# Altium schematic sheet sheet6_power_supply.SchDoc: Power Supply
size A3; Organization: Nordic Semiconductor; DocumentNumber: 6; SheetNumber: 6; SheetTotal: 6; CompanyName: Nordic Semiconductor; DocumentSize: A3
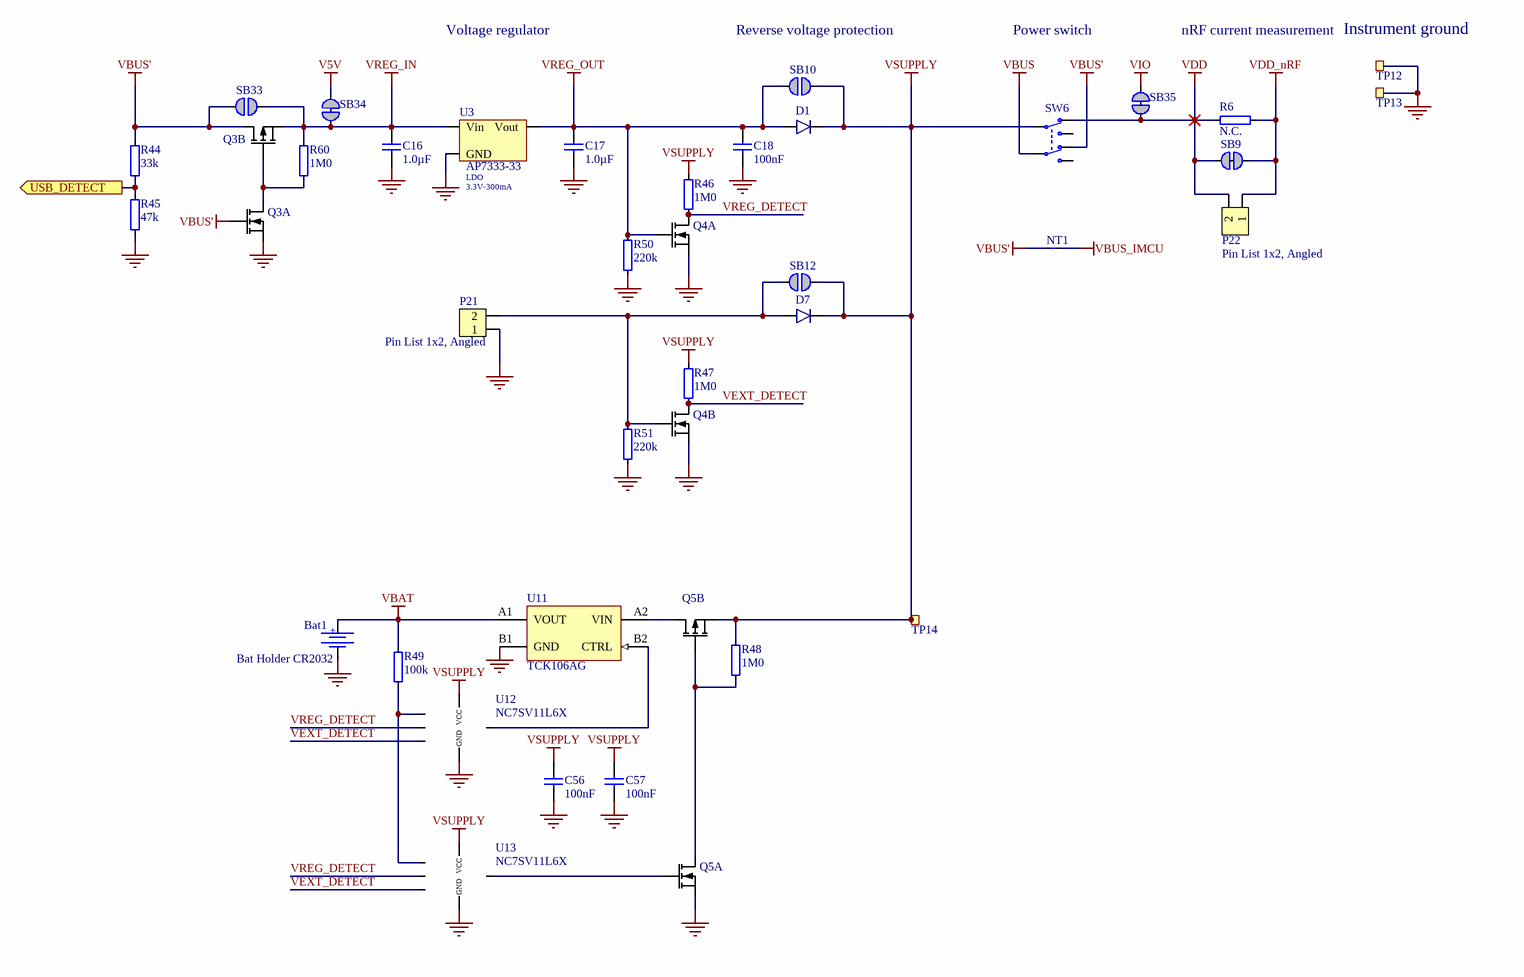
[diagram p0: sheet6_power_supply.SchDoc]

## Parts
Bat1  Bat Holder CR2032  [L-KLS5-CR2032-23-B1]
C16  1.0µF  [CAPC1608X06L]
C17  1.0µF  [CAPC1608X06L]
C18  100nF  [CAPC1005X04L]
C56  100nF  [CAPC0603X03L_C]
C57  100nF  [CAPC0603X03L_C]
D1  NSR0620P2T5G  [SODFL100X40-2N]  (value not drawn)
D7  NSR0620P2T5G  [SODFL100X40-2N]  (value not drawn)
NT1  NetTie_200um  [NetTie_200um]  (value not drawn)  (net tie, no BOM)
P21  Pin List 1x2, Angled  [LIST_ANG_1x2-SMD-2.54MM]
P22  Pin List 1x2, Angled  [LIST_ANG_1x2-SMD-2.54MM]
Q3  TSM2537CQ RFG  [DFN65P200X200X80_HS-6N]  (value not drawn)  (parts A,B of 2)
Q4  TSM250N02DCQ RFG  [DFN65P200X200X80_HS-6N]  (value not drawn)  (parts A,B of 2)
Q5  TSM2537CQ RFG  [DFN65P200X200X80_HS-6N]  (value not drawn)  (parts A,B of 2)
R6  N.C.  [RESC1005X04L_NC]
R44  33k  [RESC0603X03L_C]
R45  47k  [RESC0603X03L_C]
R46  1M0  [RESC0603X03L_C]
R47  1M0  [RESC0603X03L_C]
R48  1M0  [RESC0603X03L_C]
R49  100k  [RESC0603X03L_C]
R50  220k  [RESC0603X03L_C]
R51  220k  [RESC0603X03L_C]
R60  1M0  [RESC0603X03L_C]
SB9  Solderbridge  [Solderbridge_Shorted]  (value not drawn)  (net tie, no BOM)
SB10  Solderbridge  [Solderbridge]  (value not drawn)  (no BOM)
SB12  Solderbridge  [Solderbridge]  (value not drawn)  (no BOM)
SB33  Solderbridge  [Solderbridge]  (value not drawn)  (no BOM)
SB34  Solderbridge  [Solderbridge_Shorted]  (value not drawn)  (net tie, no BOM)
SB35  Solderbridge  [Solderbridge_Shorted_Power]  (value not drawn)  (net tie, no BOM)
SW6  MK-22D14-G2  [MK-22D14-G2]  (value not drawn)
TP12  TP  [TESTPAD-TH]  (value not drawn)  (no BOM)
TP13  TP  [TESTPAD-TH]  (value not drawn)  (no BOM)
TP14  Ø1.0mm,SMD  [TP_SMD_D1.0mm]  (value not drawn)  (no BOM)
U3  AP7333-33SAG-7  [SOT-23A]  (value not drawn)
U11  TCK106AG  [BGA4C40P2X2_76X76X62]
U12  NC7SV11L6X  [DFN1410-6N]
U13  NC7SV11L6X  [DFN1410-6N]

## Ports
USB_DETECT (out)

## Nets
GND: Bat1.2 C16.1 C17.1 C18.1 C56.1 C57.1 P21.1 Q3.1(S1) Q4.1(S1) Q4.4(S2) Q5.1(S1) R45.2 R50.2 R51.2 TP12.1 TP13.1 U3.3(GND) U11.B1(GND) U12.2(GND) U13.2(GND)
V5V: SB34.1
VBAT: Bat1.1 R49.1 U11.A1(VOUT)
VBUS: SW6.5(COM-2)
VBUS': NT1.1 Q3.2(G1) Q3.3(D2) R44.1 SB33.2 SW6.6(N.C-2)
VBUS_IMCU: NT1.2
VDD: P22.2 R6.1 SB9.2 SB35.2 SW6.3(N.C-1)
VDD_nRF: P22.1 R6.2 SB9.1
VIO: SB35.1
VREG_IN: C16.2 Q3.4(S2) R60.1 SB33.1 SB34.2 U3.1(Vin)
VREG_OUT: C17.2 C18.2 D1.2(A) Q4.2(G1) R50.1 SB10.2 U3.2(Vout)
VSUPPLY: C56.2 C57.2 D1.1(C) D7.1(C) Q5.4(S2) R46.1 R47.1 R48.1 SB10.1 SB12.1 SW6.2(COM-1) TP14.1 U12.5(VCC) U13.5(VCC)
USB_DETECT: R44.2 R45.1 ; port USB_DETECT
VEXT_DETECT: Q4.3(D2) R47.2 U12.6(C) U13.6(C)
VREG_DETECT: Q4.6(D1) R46.2 U12.3(B) U13.3(B)
NetD7_2: D7.2(A) P21.2 Q4.5(G2) R51.1 SB12.2
NetQ3_5: Q3.5(G2) Q3.6(D1) R60.2
NetQ5_2: Q5.2(G1) U13.4(Y)
NetQ5_3: Q5.3(D2) U11.A2(VIN)
NetQ5_5: Q5.5(G2) Q5.6(D1) R48.2
NetR49_2: R49.2 U12.1(A) U13.1(A)
NetU11_B2: U11.B2(CTRL) U12.4(Y)

Not connected (* = marked no-connect by the designer): SW6 1(N.O-1) 4(N.O-2)

## Notes on the sheet
- Voltage regulator
- (near SB10) Reverse voltage protection
- Power switch
- nRF current measurement
- (near TP12) Instrument ground
- (near U3) AP7333-33
- (near U3) LDO
- (near U3) 3.3V-300mA
- Size
- Date:
- A3
- PCB Assembly Number
- Sheet         of
- Revision
- File:
- Drawn By:
- (in symbol Bat Holder L-KLS5-CR2032-23-B1) +

## Library data of the parts
Bat1 = Bat Holder L-KLS5-CR2032-23-B1: Bat Holder CR2032 SMD; Manufacturer: KLS Electronic; Artikkelnr Noca: N.A.; Pad Count: 2; Part Number: Bat Holder L-KLS5-CR2032-23-B1; Manufacturer Part Number: L-KLS5-CR2032-23-B1; Footprint Doc: CR2032_HOLDER; LatestRevisionDate: 2019-08-29; Published: 2019-08-28; Value: Bat Holder CR2032; Note: Bat Holder CR2032; Part number IPS: N.A.; ComponentLink1URL: http://www.klsele.com/admin/product_upload/20151124103736KLS5-CR2032-23-B.pdf; ComponentLink1Description: Datasheet; ComponentLink2URL: N.A.; ComponentLink2Description: Supplier link; HelpURL: http://www.klsele.com/products/connectors/Coin-Cell-Holders-Series/4685.html; Supplier 1: Cabcon; Supplier Part Number 1: L-KLS5-CR2032-23-B1; Supplier 2: Mouser; Supplier Part Number 2: 614-SMTU2032-LF; PartId: 100500651; Component Class: Connectors; Author: rsk; Part number Norautron: N.A.
C16 C17 = C0603-1µ0: Capacitor, X7R, ±10%; Manufacturer: N.A.; Part number IPS: 00000000616; Note: 16V; Artikkelnr Noca: 20039282; Pad Count: 2; Published: 2009-05-08; LatestRevisionDate: 2013-06-05; Value: 1.0µF; Part Number: C0603-1µ0; Manufacturer Part Number: N.A.; Footprint Doc: 0603; ComponentLink1URL: N.A.; ComponentLink1Description: Datasheet; ComponentLink2URL: N.A.; ComponentLink2Description: Supplier link; HelpURL: N.A.; Supplier 1: N.A.; Supplier Part Number 1: N.A.; Supplier 2: N.A.; Supplier Part Number 2: N.A.; PartId: 100200271; Component Class: Capacitors; Author: rsk; Part number Norautron: N.A.
C18 = C0402-100n: Capacitor, X7R, ±10%; Manufacturer: N.A.; Part number IPS: 00000005296; Note: 16V; Artikkelnr Noca: 20039200; Pad Count: 2; Published: 2009-05-08; LatestRevisionDate: 2009-11-23; Value: 100nF; Part Number: C0402-100n; Manufacturer Part Number: N.A.; Footprint Doc: 0402; ComponentLink1URL: N.A.; ComponentLink1Description: Datasheet; ComponentLink2URL: N.A.; ComponentLink2Description: Supplier link; HelpURL: N.A.; Supplier 1: N.A.; Supplier Part Number 1: N.A.; Supplier 2: N.A.; Supplier Part Number 2: N.A.; PartId: 100200184; Component Class: Capacitors; Author: rsk; Part number Norautron: N.A.
C56 C57 = C0201-100n: Capacitor, X5R, ±10%; Manufacturer: N.A.; Part number IPS: 00000001248, 00000002505; Note: 16V; Pad Count: 2; Part Number: C0201-100n; Manufacturer Part Number: N.A.; Footprint Doc: 0201; LatestRevisionDate: 2017-11-09; Published: 2014-11-13; Value: 100nF; Artikkelnr Noca: N.A.; ComponentLink1URL: N.A.; ComponentLink1Description: Datasheet; ComponentLink2URL: N.A.; ComponentLink2Description: Supplier link; HelpURL: N.A.; Supplier 1: N.A.; Supplier Part Number 1: N.A.; Supplier 2: N.A.; Supplier Part Number 2: N.A.; PartId: 100200078; Component Class: Capacitors; Author: rsk; Part number Norautron: N.A.
D1 D7 = NSR0620P2T5G: 20V schottky barrier diode, Vf 350 mV @ 100 mA, Ir 2.0 µA @ 10 V, If 500 mA; Manufacturer: ON Semiconductor; Part number IPS: 00000009952; Note: N.A.; Artikkelnr Noca: 10029169; Pad Count: 2; Part Number: NSR0620P2T5G; Manufacturer Part Number: NSR0620P2T5G; LatestRevisionDate: 2016-07-07; Published: 2016-07-07; Value: NSR0620P2T5G; Footprint Doc: SOD-923; ComponentLink1URL: N.A.; ComponentLink1Description: Datasheet; ComponentLink2URL: N.A.; ComponentLink2Description: Supplier link; HelpURL: http://www.onsemi.com/pub_link/Collateral/NSR0620P2-D.PDF; Supplier 1: Digi-Key; Supplier Part Number 1: NSR0620P2T5GOSCT-ND; Supplier 2: N.A.; Supplier Part Number 2: N.A.; PartId: 101300131; Component Class: Semiconductors; Author: rsk; Part number Norautron: N.A.
NT1 = NetTie 0.2mm: Net Tie; Manufacturer: N.A.; Pad Count: 2; Part Number: NetTie 0.2mm; PartId: 100500654; Component Class: Connectors; Author: rsk; Manufacturer Part Number: N.A.; ComponentLink1URL: N.A.; ComponentLink1Description: Datasheet; ComponentLink2URL: N.A.; ComponentLink2Description: Supplier link; HelpURL: N.A.; Footprint Doc: NetTie; LatestRevisionDate: 2019-10-07; Published: 2019-10-07; Value: NetTie_200um; Note: N.A.; Supplier 1: N.A.; Supplier Part Number 1: N.A.; Supplier 2: N.A.; Supplier Part Number 2: N.A.; Artikkelnr Noca: N.A.; Part number IPS: N.A.; Part number Norautron: N.A.
P21 P22 = Pin List Ang 1x2 SMD, 2.54mm: Pin List 1x2, 2.54mm (100mil), Right Angled, SMD; Manufacturer: W-CON; Manufacturer Part Number: 1125B-1102S0Z135R2; Part number IPS: 00000009972; Note: N.A.; Artikkelnr Noca: 55010023; Pad Count: 2; Part Number: Pin List Ang 1x2 SMD, 2.54mm; Footprint Doc: LIST_ANG_1x2-SMD-2.54MM; LatestRevisionDate: 2016-05-26; Published: 2016-01-22; Value: Pin List 1x2, Angled; ComponentLink1URL: N.A.; ComponentLink1Description: Datasheet; ComponentLink2URL: N.A.; ComponentLink2Description: Supplier link; HelpURL: \\hizz\pro\app9717\Datasheet\connectors\W-CON\1125B-11XXXXZXXXXX.pdf; Supplier 1: Cabcon; Supplier Part Number 1: 1125B-1102S0Z135R2; Supplier 2: Samtec; Supplier Part Number 2: TSM-102-01-L-SH-A; PartId: 100500354; Component Class: Connectors; Author: rsk; Part number Norautron: N.A.
Q3 Q5 = TSM2537CQ RFG: Dual N & P Ch MOFET, 11.6A/9A, 90mOhm max, 6.25W; Manufacturer: Taiwan Semiconductor; Part number IPS: 00000001702; Note: N.A.; Pad Count: 6; Part Number: TSM2537CQ RFG; Manufacturer Part Number: TSM2537CQ RFG; ComponentLink1URL: https://www.taiwansemi.com/products/datasheet/TSM2537CQ_A1610.pdf; ComponentLink1Description: Datasheet; ComponentLink2URL: N.A.; ComponentLink2Description: Supplier link; HelpURL: https://www.taiwansemi.com/products/datasheet/TSM2537CQ_A1610.pdf; Footprint Doc: VDFN-6; LatestRevisionDate: 2018-10-29; Published: 2018-10-29; Value: TSM2537CQ RFG; Supplier 1: Digi-Key; Supplier Part Number 1: TSM2537CQRFGCT-ND; Supplier 2: N.A.; Supplier Part Number 2: N.A.; Artikkelnr Noca: N.A.; PartId: 101300160; Component Class: Semiconductors; Author: rsk; Part number Norautron: N.A.
Q4 = TSM250N02DCQ RFG: Dual N Ch MOFET, 5.8A, 55mOhm max, 620mW; Manufacturer: Taiwan Semiconductor; Part number IPS: 00000001703; Note: N.A.; Pad Count: 6; Part Number: TSM250N02DCQ RFG; Manufacturer Part Number: TSM250N02DCQ RFG; LatestRevisionDate: 2018-10-31; Published: 2018-10-31; Value: TSM250N02DCQ RFG; Artikkelnr Noca: N.A.; Footprint Doc: VDFN-6; ComponentLink1URL: https://www.taiwansemi.com/products/datasheet/TSM250N02D_B15.pdf; ComponentLink1Description: Datasheet; ComponentLink2URL: N.A.; ComponentLink2Description: Supplier link; HelpURL: https://www.taiwansemi.com/products/datasheet/TSM250N02D_B15.pdf; Supplier 1: Digi-Key; Supplier Part Number 1: TSM250N02DCQRFGCT-ND; Supplier 2: N.A.; Supplier Part Number 2: N.A.; PartId: 101300161; Component Class: Semiconductors; Author: rsk; Part number Norautron: N.A.
R6 = R0402-N.C.: Not mounted; Manufacturer: N.A.; Note: Chip Res; Assembly: Not mounted; Pad Count: 2; Part Number: R0402-N.C.; Manufacturer Part Number: N.A.; LatestRevisionDate: 2009-05-08; Published: 2009-05-08; Value: N.C.; Artikkelnr Noca: N.A.; Footprint Doc: 0402; Part number IPS: N.A.; ComponentLink1URL: N.A.; ComponentLink1Description: Datasheet; ComponentLink2URL: N.A.; ComponentLink2Description: Supplier link; HelpURL: N.A.; Supplier 1: N.A.; Supplier Part Number 1: N.A.; Supplier 2: N.A.; Supplier Part Number 2: N.A.; PartId: 100100281; Component Class: Resistors; Author: rsk; Part number Norautron: N.A.
R44 = R0201-33k: Resistor, ±1%, 0.05W; Manufacturer: N.A.; Part number IPS: 00000001708; Note: Chip Res 1%; Pad Count: 2; Part Number: R0201-33k; Manufacturer Part Number: N.A.; LatestRevisionDate: 2014-11-13; Published: 2014-11-13; Value: 33k; Artikkelnr Noca: N.A.; Footprint Doc: 0201; ComponentLink1URL: N.A.; ComponentLink1Description: Datasheet; ComponentLink2URL: N.A.; ComponentLink2Description: Supplier link; HelpURL: N.A.; Supplier 1: N.A.; Supplier Part Number 1: N.A.; Supplier 2: N.A.; Supplier Part Number 2: N.A.; PartId: 100100073; Component Class: Resistors; Author: rsk; Part number Norautron: N.A.
R45 = R0201-47k: Resistor, ±1%, 0.05W; Manufacturer: N.A.; Part number IPS: 00000001423; Note: Chip Res 1%; Pad Count: 2; Part Number: R0201-47k; Manufacturer Part Number: N.A.; LatestRevisionDate: 2014-11-13; Published: 2014-11-13; Value: 47k; Artikkelnr Noca: N.A.; Footprint Doc: 0201; ComponentLink1URL: N.A.; ComponentLink1Description: Datasheet; ComponentLink2URL: N.A.; ComponentLink2Description: Supplier link; HelpURL: N.A.; Supplier 1: N.A.; Supplier Part Number 1: N.A.; Supplier 2: N.A.; Supplier Part Number 2: N.A.; PartId: 100100076; Component Class: Resistors; Author: rsk; Part number Norautron: N.A.
R46-R48 R60 = R0201-1M0: Resistor, ±1%, 0.05W; Manufacturer: N.A.; Part number IPS: 00000001418; Note: Chip Res 1%; Pad Count: 2; Part Number: R0201-1M0; Manufacturer Part Number: N.A.; LatestRevisionDate: 2014-11-13; Published: 2014-11-13; Value: 1M0; Artikkelnr Noca: N.A.; Footprint Doc: 0201; ComponentLink1URL: N.A.; ComponentLink1Description: Datasheet; ComponentLink2URL: N.A.; ComponentLink2Description: Supplier link; HelpURL: N.A.; Supplier 1: N.A.; Supplier Part Number 1: N.A.; Supplier 2: N.A.; Supplier Part Number 2: N.A.; PartId: 100100093; Component Class: Resistors; Author: rsk; Part number Norautron: N.A.
R49 = R0201-100k: Resistor, ±1%, 0.05W; Manufacturer: N.A.; Part number IPS: 00000001419; Note: Chip Res 1%; Pad Count: 2; Part Number: R0201-100k; Manufacturer Part Number: N.A.; LatestRevisionDate: 2014-11-13; Published: 2014-11-13; Value: 100k; Artikkelnr Noca: N.A.; Footprint Doc: 0201; ComponentLink1URL: N.A.; ComponentLink1Description: Datasheet; ComponentLink2URL: N.A.; ComponentLink2Description: Supplier link; HelpURL: N.A.; Supplier 1: N.A.; Supplier Part Number 1: N.A.; Supplier 2: N.A.; Supplier Part Number 2: N.A.; PartId: 100100080; Component Class: Resistors; Author: rsk; Part number Norautron: N.A.
R50 R51 = R0201-220k: Resistor, ±1%, 0.05W; Manufacturer: N.A.; Part number IPS: 00000004789; Note: Chip Res 1%; Pad Count: 2; Part Number: R0201-220k; Manufacturer Part Number: N.A.; LatestRevisionDate: 2014-11-13; Published: 2014-11-13; Value: 220k; Artikkelnr Noca: N.A.; Footprint Doc: 0201; ComponentLink1URL: N.A.; ComponentLink1Description: Datasheet; ComponentLink2URL: N.A.; ComponentLink2Description: Supplier link; HelpURL: N.A.; Supplier 1: N.A.; Supplier Part Number 1: N.A.; Supplier 2: N.A.; Supplier Part Number 2: N.A.; PartId: 100100084; Component Class: Resistors; Author: rsk; Part number Norautron: N.A.
SB9 SB34 = Solderbridge Shorted: Shorted Solderbridge; Manufacturer: N.A.; Pad Count: 2; Part Number: Solderbridge Shorted; Manufacturer Part Number: N.A.; LatestRevisionDate: 2012-08-07; Published: 2012-08-07; Value: Solderbridge; Note: N.A.; Artikkelnr Noca: N.A.; Footprint Doc: Solderbridge_Shorted; Part number IPS: N.A.; ComponentLink1URL: N.A.; ComponentLink1Description: Datasheet; ComponentLink2URL: N.A.; ComponentLink2Description: Supplier link; HelpURL: N.A.; Supplier 1: N.A.; Supplier Part Number 1: N.A.; Supplier 2: N.A.; Supplier Part Number 2: N.A.; PartId: 100500459; Component Class: Connectors; Author: rsk; Part number Norautron: N.A.
SB10 SB12 SB33 = Solderbridge: Manufacturer: N.A.; Pad Count: 2; Part Number: Solderbridge; Manufacturer Part Number: N.A.; LatestRevisionDate: 2009-12-14; Published: 2009-12-14; Value: Solderbridge; Note: N.A.; Artikkelnr Noca: N.A.; Footprint Doc: Solderbridge; Part number IPS: N.A.; ComponentLink1URL: N.A.; ComponentLink1Description: Datasheet; ComponentLink2URL: N.A.; ComponentLink2Description: Supplier link; HelpURL: N.A.; Supplier 1: N.A.; Supplier Part Number 1: N.A.; Supplier 2: N.A.; Supplier Part Number 2: N.A.; PartId: 100500458; Component Class: Connectors; Author: rsk; Part number Norautron: N.A.
SB35 = Solderbridge Shorted Power: Shorted Solderbridge Power; Manufacturer: N.A.; Pad Count: 2; Part Number: Solderbridge Shorted Power; Manufacturer Part Number: N.A.; LatestRevisionDate: 2012-08-07; Published: 2012-08-07; Value: Solderbridge; Note: N.A.; Artikkelnr Noca: N.A.; Footprint Doc: Solderbridge_Shorted_Power; Part number IPS: N.A.; ComponentLink1URL: N.A.; ComponentLink1Description: Datasheet; ComponentLink2URL: N.A.; ComponentLink2Description: Supplier link; HelpURL: N.A.; Supplier 1: N.A.; Supplier Part Number 1: N.A.; Supplier 2: N.A.; Supplier Part Number 2: N.A.; PartId: 100500460; Component Class: Connectors; Author: rsk; Part number Norautron: N.A.
SW6 = MK-22D14-G2: Slide Switch DPDT; Manufacturer: HUA-JIE CORP.; Pad Count: 6; Note: N.A.; Part Number: MK-22D14-G2; PartId: 101500131; Component Class: Switches; Author: rsk; Manufacturer Part Number: MK-22D14-G2; ComponentLink1URL: N.A.; ComponentLink1Description: Datasheet; ComponentLink2URL: N.A.; ComponentLink2Description: Supplier link; HelpURL: N.A.; Footprint Doc: MK-22D14-G2; LatestRevisionDate: 2020-10-06; Published: 2020-12-01; Value: MK-22D14-G2; Supplier 1: Cabcon; Supplier Part Number 1: MK-22D14-G2; Supplier 2: N.A.; Supplier Part Number 2: N.A.; Artikkelnr Noca: N.A.; Part number IPS: N.A.; Part number Norautron: N.A.
TP12 TP13 = Testpoint TH: Testpoint, through hole; Manufacturer: N.A.; Pad Count: 1; Part Number: Testpoint TH; Manufacturer Part Number: N.A.; Footprint Doc: TESTPAD-TH; LatestRevisionDate: 2009-12-12; Published: 2009-12-12; Value: TP; Note: N.A.; Artikkelnr Noca: N.A.; Part number IPS: N.A.; ComponentLink1URL: N.A.; ComponentLink1Description: Datasheet; ComponentLink2URL: N.A.; ComponentLink2Description: Supplier link; HelpURL: N.A.; Supplier 1: N.A.; Supplier Part Number 1: N.A.; Supplier 2: N.A.; Supplier Part Number 2: N.A.; PartId: 100500464; Component Class: Connectors; Author: rsk; Part number Norautron: N.A.
TP14 = TP_SMD_Ø1.0MM: 1.0mm circular SMD testpad; Manufacturer: Nordic Semiconductor; Manufacturer Part Number: N.A.; Pad Count: 1; Part Number: TP_SMD_Ø1.0MM; LatestRevisionDate: 2021-03-05; Published: 2013-06-11; Value: Ø1.0mm,SMD; Note: N.A.; Artikkelnr Noca: N.A.; Footprint Doc: TP_SMD_Ø1.0mm; Part number IPS: N.A.; ComponentLink1URL: N.A.; ComponentLink1Description: Datasheet; ComponentLink2URL: N.A.; ComponentLink2Description: Supplier link; HelpURL: N.A.; Supplier 1: N.A.; Supplier Part Number 1: N.A.; Supplier 2: N.A.; Supplier Part Number 2: N.A.; PartId: 100500475; Component Class: Connectors; Author: rsk; Part number Norautron: N.A.
U3 = AP7333-33SAG-7: 300mA, Low Quiescent Current, Fast Transient Low Dropout Linear Regulator; Manufacturer: Diodes Incorporated; Part number IPS: 00000001673; Note: N.A.; Artikkelnr Noca: 17039216; Pad Count: 3; Part Number: AP7333-33SAG-7; Manufacturer Part Number: AP7333-33SAG-7; LatestRevisionDate: 2012-06-15; Published: 2012-06-15; Value: AP7333-33SAG-7; Footprint Doc: SOT-23-3; ComponentLink1URL: N.A.; ComponentLink1Description: Datasheet; ComponentLink2URL: N.A.; ComponentLink2Description: Supplier link; HelpURL: http://www.diodes.com/datasheets/AP7333.pdf; Supplier 1: Digi-Key; Supplier Part Number 1: AP7333-33SAG-7DICT-ND; Supplier 2: N.A.; Supplier Part Number 2: N.A.; PartId: 101900020; Component Class: Misc_ICs; Author: rsk; Part number Norautron: N.A.
U11 = TCK106AG: 1.0 A Load Switch IC with Slew Rate Control Driver in Ultra Small Package; Manufacturer: Toshiba; Manufacturer Part Number: TCK106AG,LF; Part number IPS: 00000004390; Note: N.A.; Pad Count: 4; Part Number: TCK106AG; Footprint Doc: WLCSP-4; LatestRevisionDate: 2019-03-01; Published: 2019-02-17; Value: TCK106AG; Artikkelnr Noca: N.A.; ComponentLink1URL: https://toshiba.semicon-storage.com/info/docget.jsp?did=30131&prodName=TCK106AG; ComponentLink1Description: Datasheet; ComponentLink2URL: N.A.; ComponentLink2Description: Supplier link; HelpURL: N.A.; Supplier 1: Digi-Key; Supplier Part Number 1: TCK106AGLFTR-ND; Supplier 2: Mouser; Supplier Part Number 2: 757-TCK106AGLF; PartId: 101900575; Component Class: Misc_ICs; Author: rsk; Part number Norautron: N.A.
U12 U13 = NC7SV11L6X: Single 3-input AND gate; Manufacturer: ON Semiconductor; Part number IPS: 00000001709; Artikkelnr Noca: N.A.; Pad Count: 6; Part Number: NC7SV11L6X; Manufacturer Part Number: NC7SV11L6X; ComponentLink1URL: https://www.fairchildsemi.com/datasheets/NC/NC7SV11.pdf; ComponentLink1Description: Datasheet; ComponentLink2URL: N.A.; ComponentLink2Description: Supplier link; HelpURL: https://www.fairchildsemi.com/datasheets/NC/NC7SV11.pdf; Footprint Doc: UFDFN-6; LatestRevisionDate: 2018-09-27; Published: 2018-09-27; Value: NC7SV11L6X; Note: Single 3-input AND gate; Supplier 1: Digi-Key; Supplier Part Number 1: NC7SV11L6XCT-ND; Supplier 2: Mouser; Supplier Part Number 2: 512-NC7SV11L6X; PartId: 101900559; Component Class: Misc_ICs; Author: rsk; Part number Norautron: N.A.